# EAGLE design ME433_PIC32_Schematic (EAGLE 8.1.0)
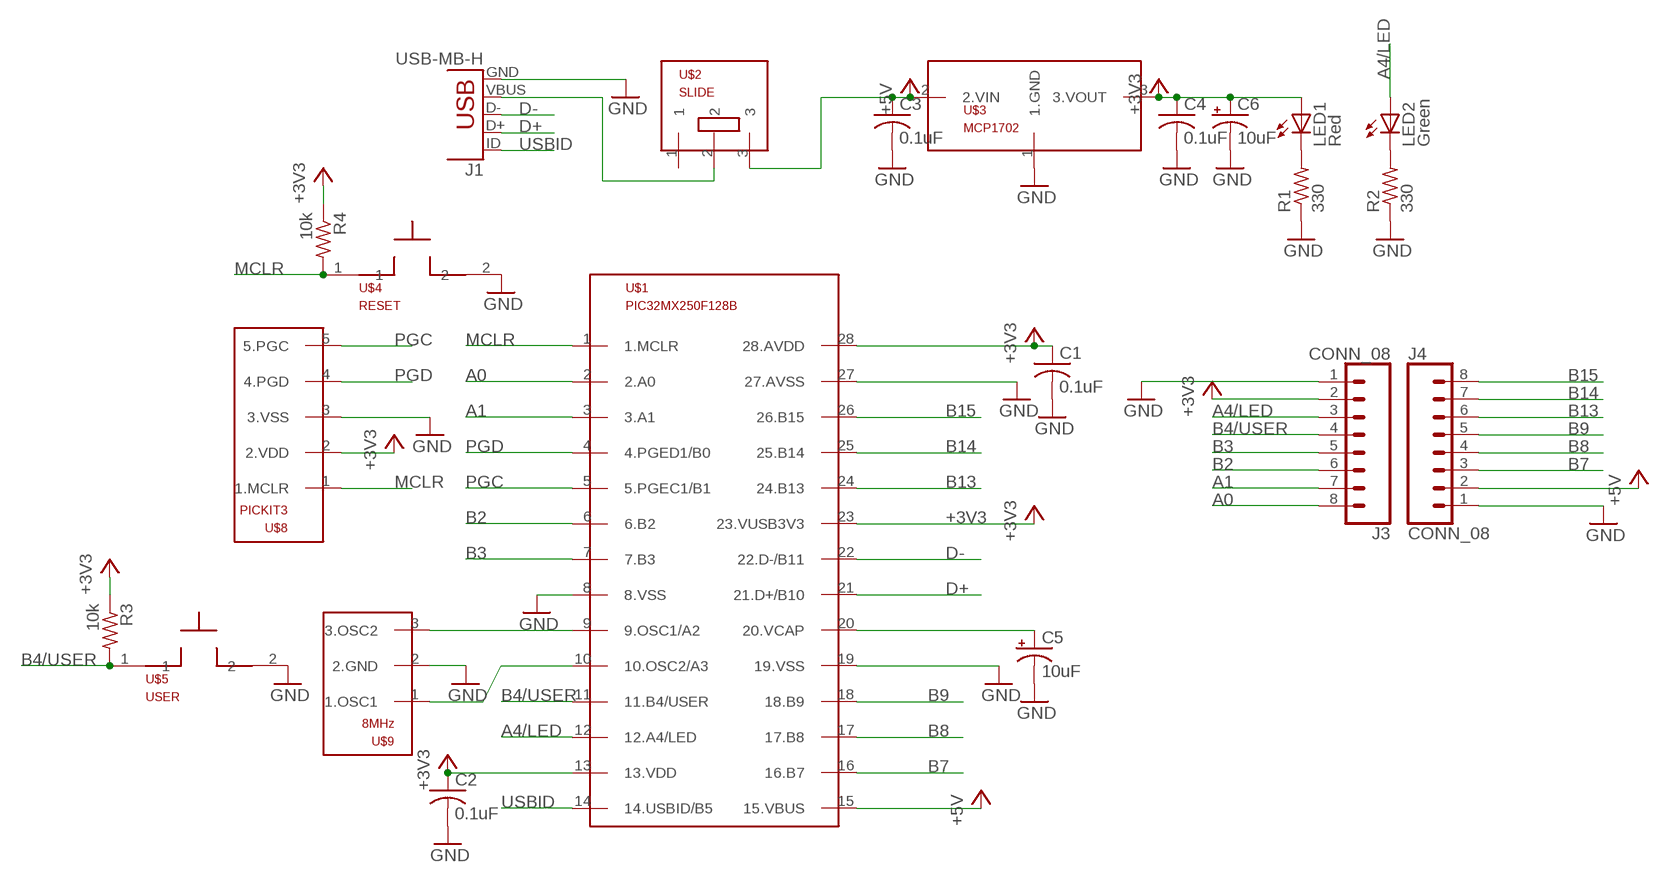
[diagram p0: schematic, sheet 1]

## Parts
C1  0.1uF  C-US025-025X050  [C025-025X050]
C2  0.1uF  C-US025-025X050  [C025-025X050]
C3  0.1uF  C-US025-025X050  [C025-025X050]
C4  0.1uF  C-US025-025X050  [C025-025X050]
C5  10uF  CPOL-USB45181B  [B45181B]
C6  10uF  CPOL-USB45181B  [B45181B]
J1  USB-MB-H  [USB-MB-H]
J3  CONN_08  [1X08]
J4  CONN_08  [1X08]
LED1  Red  LED3MM  [LED3MM]
LED2  Green  LED3MM  [LED3MM]
R1  330  R-US_0207/10  [0207/10]
R2  330  R-US_0207/10  [0207/10]
R3  10k  R-US_0207/10  [0207/10]
R4  10k  R-US_0207/10  [0207/10]
U$1  PIC32MX250F128B  [DIL28-3]
U$2  SLIDE  [SLIDE]
U$3  MCP1702  [TO92]
U$4  RESET  PB  [PB]
U$5  USER  PB  [PB]
U$8  PICKIT3  [1X05]
U$9  8MHz  OSC  [OSC]

## Nets
+3V3: C1.1 C2.1 C4.1 C6.+ J3.2 LED1.A R3.1 R4.1 U$1.13(13.VDD) U$1.23(23.VUSB3V3) U$1.28(28.AVDD) U$3.3(3.VOUT) U$8.2(2.VDD)
+5V: C3.1 J4.2 U$1.15(15.VBUS) U$2.3 U$3.2(2.VIN)
A0: J3.8 U$1.2(2.A0)
A1: J3.7 U$1.3(3.A1)
A4/LED: J3.3 LED2.A U$1.12(12.A4/LED)
B2: J3.6 U$1.6(6.B2)
B3: J3.5 U$1.7(7.B3)
B4/USER: J3.4 R3.2 U$1.11(11.B4/USER) U$5.1
B7: J4.3 U$1.16(16.B7)
B8: J4.4 U$1.17(17.B8)
B9: J4.5 U$1.18(18.B9)
B13: J4.6 U$1.24(24.B13)
B14: J4.7 U$1.25(25.B14)
B15: J4.8 U$1.26(26.B15)
D+: J1.D+ U$1.21(21.D+/B10)
D-: J1.D- U$1.22(22.D-/B11)
GND: C1.2 C2.2 C3.2 C4.2 C5.- C6.- J1.GND J3.1 J4.1 R1.1 R2.1 U$1.8(8.VSS) U$1.19(19.VSS) U$1.27(27.AVSS) U$3.1(1.GND) U$4.2 U$5.2 U$8.3(3.VSS) U$9.2(2.GND)
MCLR: R4.2 U$1.1(1.MCLR) U$4.1 U$8.1(1.MCLR)
N$1: J1.VBUS U$2.2
N$2: U$1.9(9.OSC1/A2) U$9.3(3.OSC2)
N$3: LED1.K(C) R1.2
N$4: U$1.10(10.OSC2/A3) U$9.1(1.OSC1)
N$5: C5.+ U$1.20(20.VCAP)
N$6: LED2.K(C) R2.2
PGC: U$1.5(5.PGEC1/B1) U$8.5(5.PGC)
PGD: U$1.4(4.PGED1/B0) U$8.4(4.PGD)
USBID: J1.ID U$1.14(14.USBID/B5)
Unconnected: U$2.1

## Library data of the parts
C1-C4 = ME433_PIC32_Library:C-US: CAPACITOR, American symbol
C5 C6 = ME433_PIC32_Library:CPOL-US: POLARIZED CAPACITOR, American symbol
J1 = ME433_PIC32_Library:USB: USB Connectors USB-B-PTH is fully proven SKU : PRT-00139/CONN-08278 USB-miniB is fully proven SKU : PRT-00587 USB-A-PCB is untested. USB-A-H is throughly reviewed, but untested. Spark Fun Electronics SKU : PRT-00437 USB-B-SMT is throughly reviewed, but untested. Needs silkscreen touching up. USB-A-S has not been used/tested USB-MB-H has not been used/tested USB-MICROB has been used. CONN-09505
J3 J4 = ME433_PIC32_Library:CONN_08
LED1 LED2 = led:LED: LED OSRAM: - CHIPLED LG R971, LG N971, LY N971, LG Q971, LY Q971, LO R971, LY R971 LH N974, LH R974 LS Q976, LO Q976, LY Q976 LO Q996 - Hyper CHIPLED LW Q18S LB Q993, LB Q99A, LB R99A - SideLED LS A670, LO A670, LY A670, LG A670, LP A670 LB A673, LV A673, LT A673, LW A673 LH A674 LY A675 LS A676, LA A676, LO A676, LY A676, LW A676 LS A679, LY A679, LG A679 - Hyper Micro SIDELED® LS Y876, LA Y876, LO Y876, LY Y876 LT Y87S - SmartLED LW L88C, LW L88S LB L89C, LB L89S, LG L890 LS L89K, LO L89K, LY L89K LS L896, LA L896, LO L896, LY L896 - TOPLED LS T670, LO T670, LY T670, LG T670, LP T670 LSG T670, LSP T670, LSY T670, LOP T670, LYG T670 LG T671, LOG T671, LSG T671 LB T673, LV T673, LT T673, LW T673 LH T674 LS T676, LA T676, LO T676, LY T676, LB T676, LH T676, LSB T676, LW T676 LB T67C, LV T67C, LT T67C, LS T67K, LO T67K, LY T67K, LW E67C LS E67B, LA E67B, LO E67B, LY E67B, LB E67C, LV E67C, LT E67C LW T67C LS T679, LY T679, LG T679 LS T770, LO T770, LY T770, LG T770, LP T770 LB T773, LV T773, LT T773, LW T773 LH T774 LS E675, LA E675, LY E675, LS T675 LS T776, LA T776, LO T776, LY T776, LB T776 LHGB T686 LT T68C, LB T68C - Hyper Mini TOPLED® LB M676 - Mini TOPLED Santana® LG M470 LS M47K, LO M47K, LY M47K Source: http://www.osram.convergy.de LUXEON: - LUMILED® LXK2-PW12-R00, LXK2-PW12-S00, LXK2-PW14-U00, LXK2-PW14-V00 LXK2-PM12-R00, LXK2-PM12-S00, LXK2-PM14-U00 LXK2-PE12-Q00, LXK2-PE12-R00, LXK2-PE12-S00, LXK2-PE14-T00, LXK2-PE14-U00 LXK2-PB12-K00, LXK2-PB12-L00, LXK2-PB12-M00, LXK2-PB14-N00, LXK2-PB14-P00, LXK2-PB14-Q00 LXK2-PR12-L00, LXK2-PR12-M00, LXK2-PR14-Q00, LXK2-PR14-R00 LXK2-PD12-Q00, LXK2-PD12-R00, LXK2-PD12-S00 LXK2-PH12-R00, LXK2-PH12-S00 LXK2-PL12-P00, LXK2-PL12-Q00, LXK2-PL12-R00 Source: www.luxeon.com KINGBRIGHT: KA-3528ASYC Source: www.kingbright.com
R1-R4 = ME433_PIC32_Library:R-US_: RESISTOR, American symbol
U$1 = ME433_PIC32_Library:PIC32MX250F128B
U$2 = ME433_PIC32_Library:SLIDE
U$3 = ME433_PIC32_Library:MCP1702
U$4 U$5 = ME433_PIC32_Library:PB
U$8 = ME433_PIC32_Library:PICKIT3
U$9 = ME433_PIC32_Library:OSC

## Board
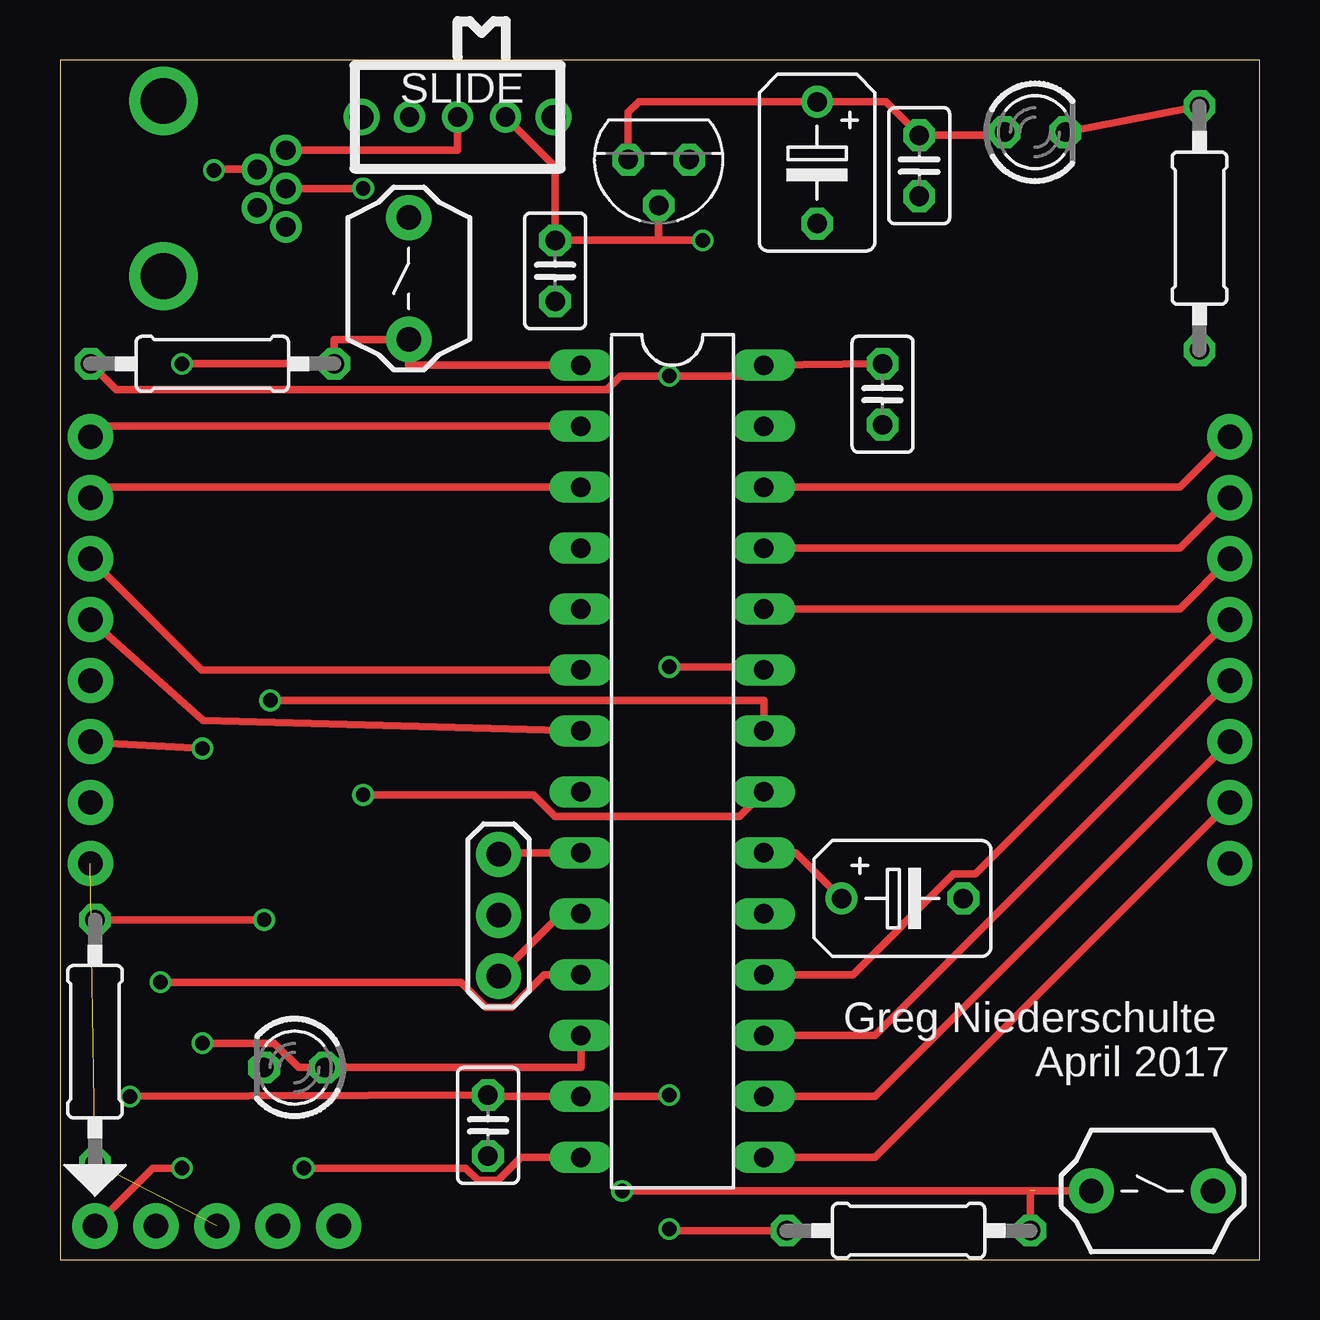
[diagram p1: board, top side]
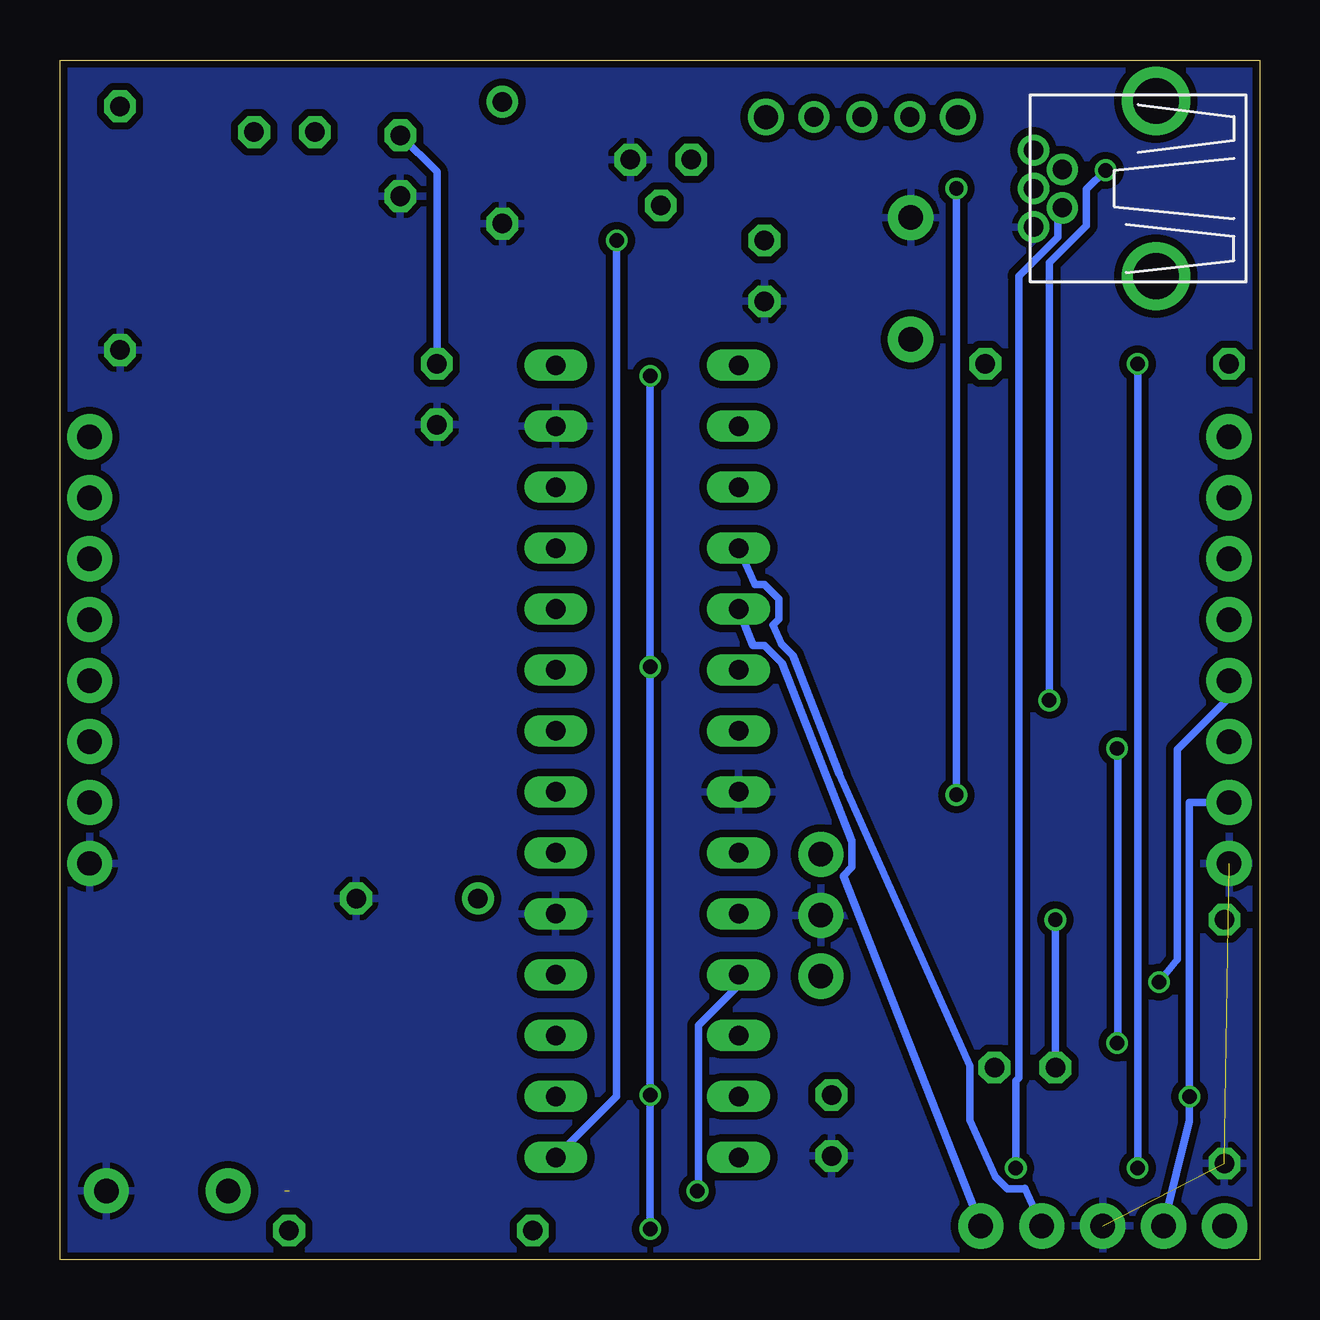
[diagram p2: board, bottom side, seen from below]

Size 50 x 50 mm. Coordinates in mm from the lower left corner, seen from the top.
Outline: 0,0 50,0 50,50 0,50 0,0
Copper layers (1*16): Top 0.035mm / dielectric 1.5mm / Bottom 0.035mm
Design rules "SeeedStudio_2layer_DRU_no_angle_20140221": minimum track width 6mil, minimum drill 12mil, track to track 6mil, track to pad 6mil, pad to pad 6mil, via to via 6mil, smd to smd 0mil, copper to edge 10mil, drill to drill 10mil, minimum pad ring 10mil, minimum via ring 6mil, stop-mask expansion 2mil, vias tented up to drill 100mil, thermal gap 10mil

### Footprints (pad centres in the part's own frame; a part is rotated, then mirrored left to right if it is on the bottom)
C025-025X050 = drill 0.813 octagon: 1 -1.27,0; 2 1.27,0
B45181B = drill 0.813: + -2.54,0 | drill 0.813 octagon: - 2.54,0
USB-MB-H = drill 0.8: D+ 5.1,0; D- 3.9,0.8; GND 5.1,-1.6; ID 3.9,-0.8; VBUS 5.1,1.6 | drill 1.9: P$6 0,-3.65; P$7 0,3.65
1X08 = drill 1.016 pad 1.88: 1 0,0; 2 2.54,0; 3 5.08,0; 4 7.62,0; 5 10.16,0; 6 12.7,0; 7 15.24,0; 8 17.78,0
LED3MM = drill 0.813 octagon: A -1.27,0; K 1.27,0
0207/10 = drill 0.813 octagon: 1 -5.08,0; 2 5.08,0
DIL28-3 = drill 0.813 long: 1 -16.51,-3.81; 2 -13.97,-3.81; 3 -11.43,-3.81; 4 -8.89,-3.81; 5 -6.35,-3.81; 6 -3.81,-3.81; 7 -1.27,-3.81; 8 1.27,-3.81; 9 3.81,-3.81; 10 6.35,-3.81; 11 8.89,-3.81; 12 11.43,-3.81; 13 13.97,-3.81; 14 16.51,-3.81; 15 16.51,3.81; 16 13.97,3.81; 17 11.43,3.81; 18 8.89,3.81; 19 6.35,3.81; 20 3.81,3.81; 21 1.27,3.81; 22 -1.27,3.81; 23 -3.81,3.81; 24 -6.35,3.81; 25 -8.89,3.81; 26 -11.43,3.81; 27 -13.97,3.81; 28 -16.51,3.81
SLIDE = drill 0.8: 1 -2,0; 2 0,0; 3 2,0 | drill 1: P$1 -4,0; P$2 4,0
TO92 = drill 0.813 octagon: 1 -1.27,0; 2 0,1.905; 3 1.27,0
PB = drill 1.016 pad 1.88: 1 0,0; 2 5.08,0
1X05 = drill 1.016 pad 1.88: 1 0,0; 2 2.54,0; 3 5.08,0; 4 7.62,0; 5 10.16,0
OSC = drill 1.016 pad 1.88: 1 0,0; 2 2.54,0; 3 5.08,0

### Placement (x,y rotation side)
C1  34.29,36.07 270 top
C2  17.84,5.59 270 top
C3  20.64,41.21 270 top
C4  35.81,45.59 270 top
C5  35.12,15.05 0 top
C6  31.56,45.72 270 top
J1  4.32,44.64 0 top
J3  1.27,16.51 90 top
J4  48.77,16.51 90 top
LED1  40.64,46.99 0 top
LED2  9.78,8 180 top
R1  47.5,42.99 90 top
R2  1.46,9.08 90 top
R3  35.37,1.21 0 top
R4  6.35,37.34 0 top
U$1  25.53,20.76 270 top
U$2  16.57,47.62 0 top
U$3  24.96,45.85 180 top
U$4  14.54,38.35 90 top
U$5  42.99,2.86 0 top
U$8  1.46,1.4 0 top
U$9  18.29,11.81 90 top

### Tracks (layer width: path | path; a pad name or v marks a point on that pad's centre or on a via)
+3V3  (via drill 0.6)
  Top 0.305: U$3.3 23.69,47.82 24.13,48.26 C6.+ 34.42,48.26 C4.1 39.24,46.86 LED1.A | 34.29,37.27 C1.1 U$1.28 29.34,36.83 v25.4,36.83 23.37,36.83 22.8,36.26 2.35,36.26 R4.1 | v25.4,1.27 25.4,1.21 R3.1 | v25.4,6.86 25.4,6.79 U$1.13 17.84,6.79 C2.1 v2.92,6.79 | v25.4,24.7 29.34,24.7 U$1.23
  Bottom 0.305: C4.1 34.29,45.34 C1.1 | v25.4,36.83 v25.4,24.7 v25.4,6.86 v25.4,1.27 | U$8.2 2.92,5.78 v2.92,6.79 2.92,19.05 J3.2
+5V  (via drill 0.6)
  Top 0.305: U$2.3 20.64,45.56 C3.1 24.96,42.48 | 24.96,42.48 U$3.2 | 24.96,42.48 v26.8,42.48 | U$1.15 33.97,4.25 J4.2
  Bottom 0.305: v26.8,42.48 26.8,6.79 U$1.15
A0
  Top 0.305: U$1.2 1.27,34.73 J3.8
A1
  Top 0.305: U$1.3 1.27,32.19 J3.7
A4/LED  (via drill 0.6)
  Top 0.305: U$1.12 21.72,8 LED2.A 9.95,8 8.93,9.02 v5.94,9.02 | v5.94,21.3 1.27,21.56 J3.3
  Bottom 0.305: v5.94,9.02 5.91,9.02 5.91,21.34 5.94,21.34 v5.94,21.3
B2
  Top 0.305: U$1.6 5.91,24.57 J3.6
B3
  Top 0.305: U$1.7 5.97,22.48 J3.5
B4/USER  (via drill 0.6)  (1 unrouted)
  Top 0.305: U$5.1 40.45,2.86 R3.2 | 40.64,2.86 v23.43,2.86 | U$1.11 20.18,11.87 18.82,10.52 17.75,10.52 16.71,11.56 v4.19,11.56 4.32,11.56
  Bottom 0.305: U$1.11 21.72,11.43 23.39,9.76 23.39,2.9 v23.43,2.86 | v4.19,11.56 3.43,12.51 3.43,21.26 1.27,23.42 J3.4
B7
  Top 0.305: U$1.16 33.97,6.79 J4.3
B8
  Top 0.305: U$1.17 33.97,9.34 J4.4
B9
  Top 0.305: J4.5 38.16,16.07 37.23,16.07 33.04,11.87 U$1.18
B13
  Top 0.305: U$1.24 46.67,27.11 J4.6
B14
  Top 0.305: U$1.25 46.67,29.65 J4.7
B15
  Top 0.305: U$1.26 46.67,32.19 J4.8
D+  (via drill 0.6)
  Top 0.305: J1.D+ v12.64,44.64 11.11,44.64 | v12.64,19.37 19.75,19.37 20.64,18.48 28.32,18.48 U$1.21
  Bottom 0.305: v12.64,44.64 v12.64,19.37 12.64,19.3
D-  (via drill 0.6)
  Top 0.305: J1.D- 6.41,45.44 v6.41,45.4 | v8.76,23.3 29.34,23.3 U$1.22
  Bottom 0.305: v8.76,23.3 8.76,41.55 7.21,43.1 7.21,44.61 v6.41,45.4
GND  (2 unrouted)
  pour Bottom (isolate 0.305): 0,49.53 0,0 50.8,0 50.8,49.53
MCLR  (via drill 0.6)
  Top 0.305: U$1.1 14.54,37.27 U$4.1 11.43,38.35 R4.2 v5.08,37.34 | v5.08,3.81 3.87,3.81 U$8.1
  Bottom 0.305: v5.08,3.81 v5.08,37.34
N$1
  Top 0.305: J1.VBUS 16.57,46.24 U$2.2
N$2
  Top 0.305: U$1.9 18.29,16.95 U$9.3
N$3
  Top 0.305: LED1.K R1.2
N$4
  Top 0.305: U$1.10 20.89,14.41 U$9.1
N$5
  Top 0.305: U$1.20 30.67,16.95 C5.+
N$6  (via drill 0.6)
  Top 0.305: R2.2 v8.51,14.16
  Bottom 0.305: v8.51,14.16 LED2.K
PGC
  Bottom 0.305: U$8.5 17.35,15.99 16.99,16.35 16.99,17.43 19.91,24.87 20.64,25.59 21.12,25.59 U$1.5
PGD
  Bottom 0.305: U$1.4 21.04,28.13 20.64,28.13 20.04,27.54 20.04,26.69 20.28,26.45 19.93,25.66 19.44,25.18 17.5,20.23 12.06,8.07 12.06,5.79 11.02,3.45 10.52,2.95 9.8,2.95 9.78,2.96 U$8.4
USBID  (via drill 0.6)
  Top 0.305: U$1.14 19.22,4.25 18.26,3.3 17.42,3.3 16.91,3.81 v10.16,3.81
  Bottom 0.305: v10.16,3.81 10.16,7.45 10.03,7.58 10.03,41 8.41,42.62 8.41,43.65 J1.ID

### Text on the board
tPlace: Greg Niederschulte | April 2017